# EAGLE schematic CNC (EAGLE 9.2.0)
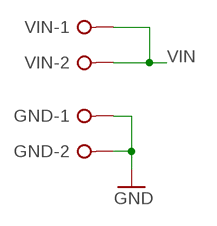
[diagram p0: schematic, sheet 1, part 1 of 2]
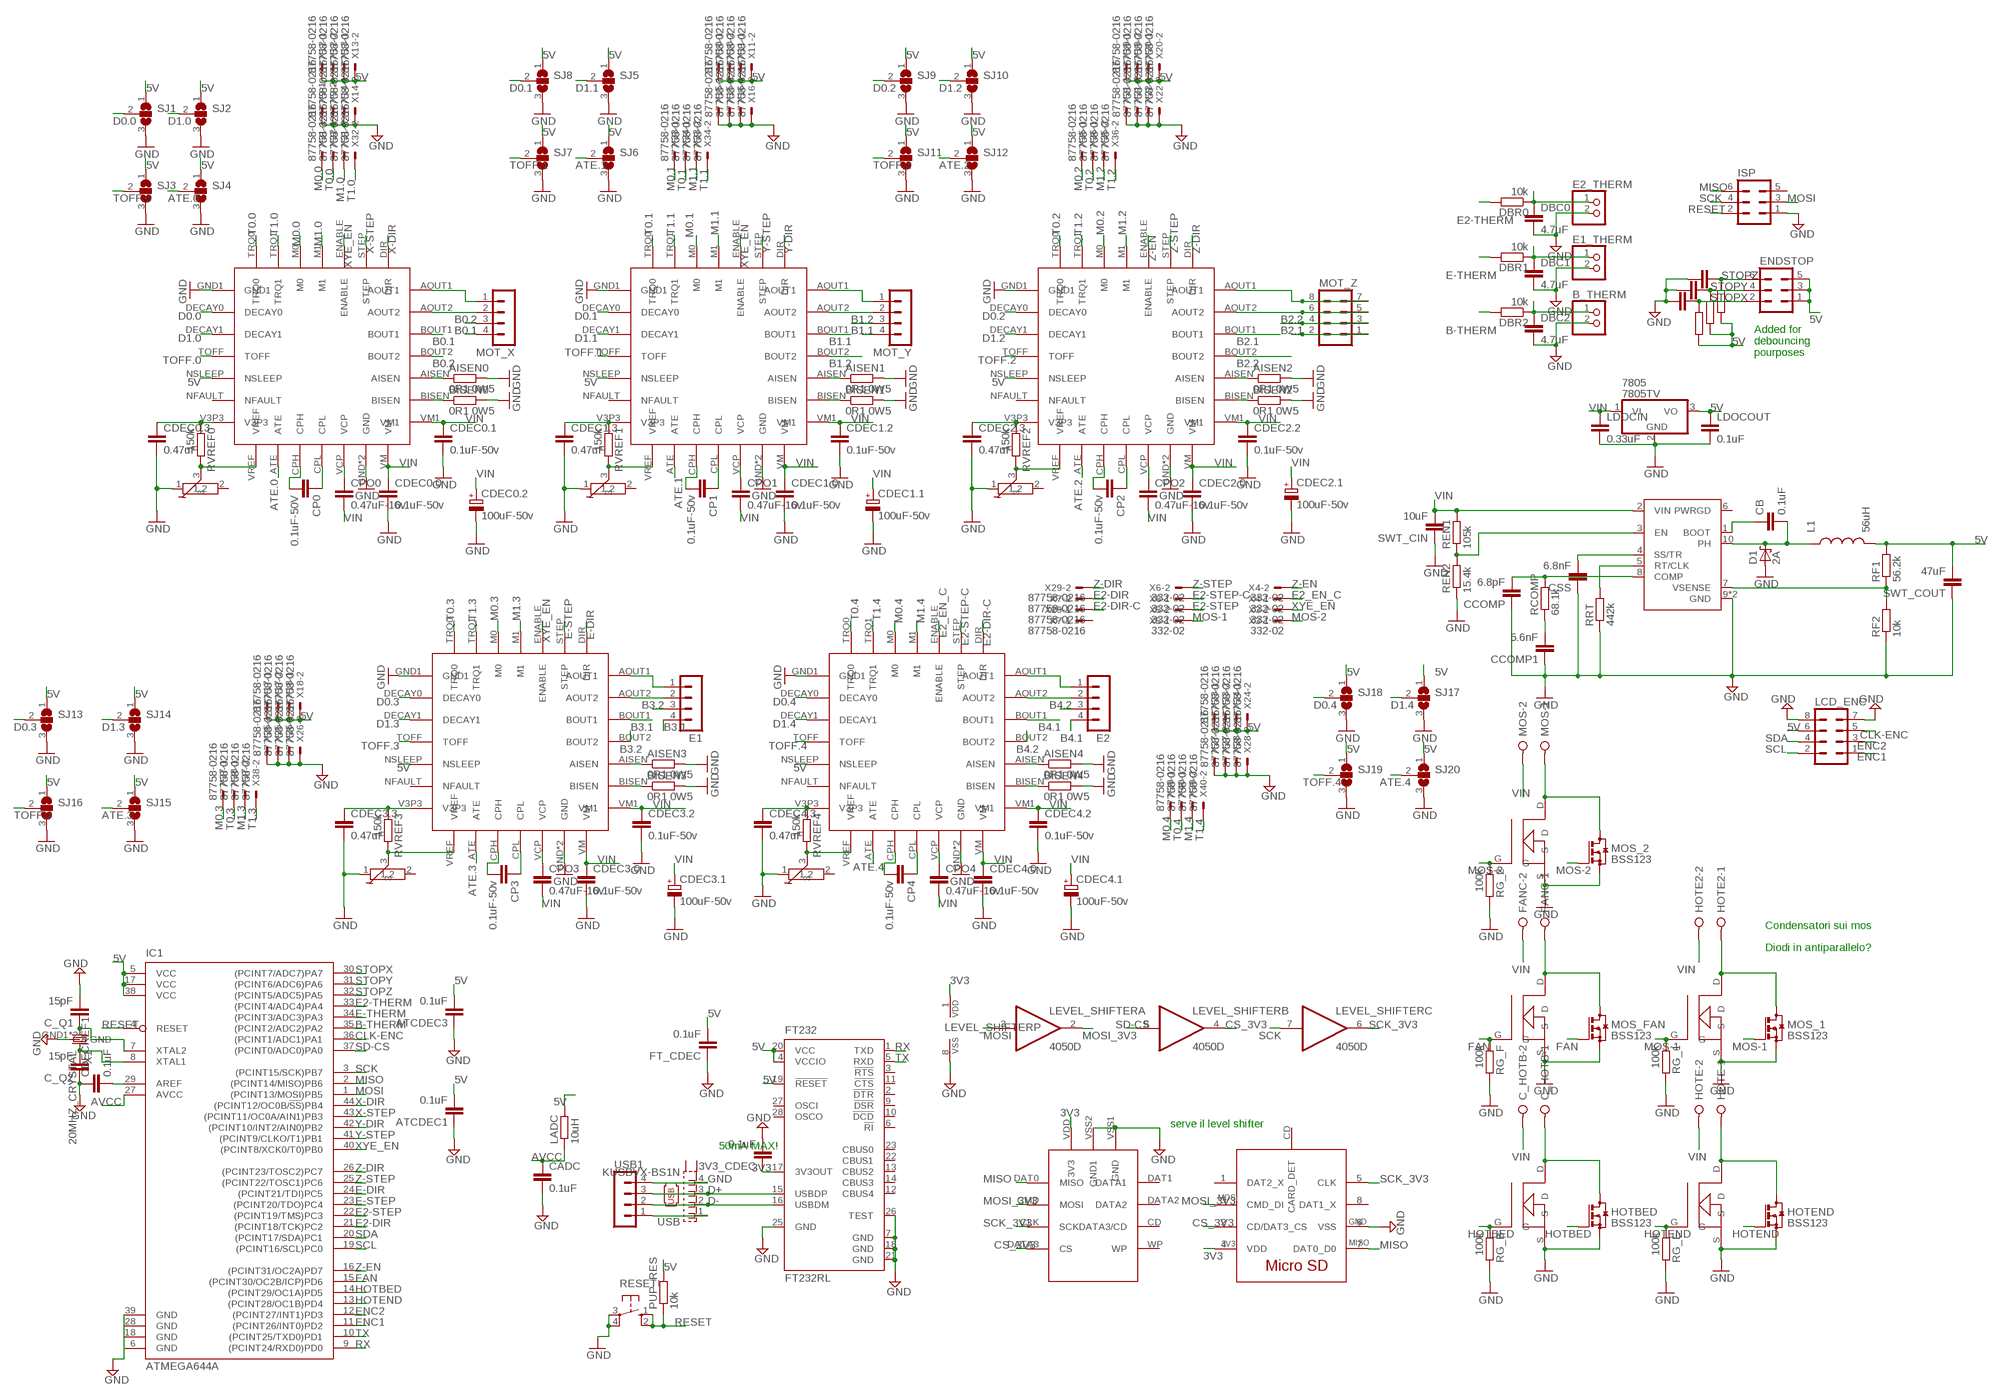
[diagram p1: schematic, sheet 1, part 2 of 2]

## Parts
3V3_CDEC  0.1uF  C-EUC0603  [C0603]
7805  7805TV  [TO220V]
AISEN0  0R1 0W5  R-EU_R0805  [R0805]
AISEN1  0R1 0W5  R-EU_R0805  [R0805]
AISEN2  0R1 0W5  R-EU_R0805  [R0805]
AISEN3  0R1 0W5  R-EU_R0805  [R0805]
AISEN4  0R1 0W5  R-EU_R0805  [R0805]
ATCDEC1  0.1uF  C-EUC0603  [C0603]
ATCDEC3  0.1uF  C-EUC0603  [C0603]
B_THERM  PINHD-1X2  [1X02]
BISEN0  0R1 0W5  R-EU_R0805  [R0805]
BISEN1  0R1 0W5  R-EU_R0805  [R0805]
BISEN2  0R1 0W5  R-EU_R0805  [R0805]
BISEN3  0R1 0W5  R-EU_R0805  [R0805]
BISEN4  0R1 0W5  R-EU_R0805  [R0805]
C_HOTB  W237-02P  [W237-132]
C_Q1  15pF  C-EUC0603  [C0603]
C_Q2  15pF  C-EUC0603  [C0603]
CADC  0.1uF  C-EUC0603  [C0603]
CB  0.1uF  C-EUC0603  [C0603]
CCOMP  6.8pF  C-EUC0603  [C0603]
CCOMP1  5.6nF  C-EUC0603  [C0603]
CDEC0.0  0.1uF-50v  C-EUC0603  [C0603]
CDEC0.1  0.1uF-50v  C-EUC0603  [C0603]
CDEC0.2  100uF-50v  CPOL-EUE3.5-8  [E3,5-8]
CDEC0.3  0.47uF  C-EUC0603  [C0603]
CDEC1.0  0.1uF-50v  C-EUC0603  [C0603]
CDEC1.1  100uF-50v  CPOL-EUE3.5-8  [E3,5-8]
CDEC1.2  0.1uF-50v  C-EUC0603  [C0603]
CDEC1.3  0.47uF  C-EUC0603  [C0603]
CDEC2.0  0.1uF-50v  C-EUC0603  [C0603]
CDEC2.1  100uF-50v  CPOL-EUE3.5-8  [E3,5-8]
CDEC2.2  0.1uF-50v  C-EUC0603  [C0603]
CDEC2.3  0.47uF  C-EUC0603  [C0603]
CDEC3.0  0.1uF-50v  C-EUC0603  [C0603]
CDEC3.1  100uF-50v  CPOL-EUE3.5-8  [E3,5-8]
CDEC3.2  0.1uF-50v  C-EUC0603  [C0603]
CDEC3.3  0.47uF  C-EUC0603  [C0603]
CDEC4.0  0.1uF-50v  C-EUC0603  [C0603]
CDEC4.1  100uF-50v  CPOL-EUE3.5-8  [E3,5-8]
CDEC4.2  0.1uF-50v  C-EUC0603  [C0603]
CDEC4.3  0.47uF  C-EUC0603  [C0603]
CDECREF1  0.1uF  C-EUC0603  [C0603]
CP0  0.1uF-50V  C-EUC0603  [C0603]
CP1  0.1uF-50v  C-EUC0603  [C0603]
CP2  0.1uF-50v  C-EUC0603  [C0603]
CP3  0.1uF-50v  C-EUC0603  [C0603]
CP4  0.1uF-50v  C-EUC0603  [C0603]
CPO0  0.47uF-16v  C-EUC0603  [C0603]
CPO1  0.47uF-16v  C-EUC0603  [C0603]
CPO2  0.47uF-16v  C-EUC0603  [C0603]
CPO3  0.47uF-16v  C-EUC0603  [C0603]
CPO4  0.47uF-16v  C-EUC0603  [C0603]
CSS  6.8nF  C-EUC0603  [C0603]
D1  2A  MBRS130LT3  [SMB]
DBC0  4.7uF  C-EUC0603  [C0603]
DBC1  4.7uF  C-EUC0603  [C0603]
DBC2  4.7uF  C-EUC0603  [C0603]
DBC3  0.1uF  C-EUC0603  [C0603]
DBC4  0.1uF  C-EUC0603  [C0603]
DBC5  0.1uF  C-EUC0603  [C0603]
DBR0  10k  R-EU_R0603  [R0603]
DBR1  10k  R-EU_R0603  [R0603]
DBR2  10k  R-EU_R0603  [R0603]
DBR3  10k  R-EU_R0603  [R0603]
DBR4  10k  R-EU_R0603  [R0603]
DBR5  10k  R-EU_R0603  [R0603]
E1  MA04-1  [MA04-1]
E1_THERM  PINHD-1X2  [1X02]
E2  MA04-1  [MA04-1]
E2_THERM  PINHD-1X2  [1X02]
ENDSTOP  MA03-2  [MA03-2]
EXT_1  DRV8880  [HTSSOP]
EXT_2  DRV8880  [HTSSOP]
FANC  W237-02P  [W237-132]
FT232  FT232RL  [SSOP28]
FT_CDEC  0.1uF  C-EUC0603  [C0603]
GND  W237-02P  [W237-132]
HOTBED  BSS123  [SOT23]
HOTBED1  POWER_MOSFET  [D2PAK]
HOTE  W237-02P  [W237-132]
HOTE2  W237-02P  [W237-132]
HOTEND  BSS123  [SOT23]
HOTEND1  POWER_MOSFET  [D2PAK]
IC1  ATMEGA644A  [TQFP44]
ISP  MA03-2  [MA03-2]
L1  56uH  INDUCTOR  [INDUCTOR]
LADC  10uH  R-EU_R0603  [R0603]
LCD_ENC  MA04-2  [MA04-2]
LDOCIN  0.33uF  C-EUC0603  [C0603]
LDOCOUT  0.1uF  C-EUC0603  [C0603]
LEVEL_SHIFTER  4050D  [SO16]
MOS  W237-02P  [W237-132]
MOS11  POWER_MOSFET  [D2PAK]
MOS22  POWER_MOSFET  [D2PAK]
MOS_1  BSS123  [SOT23]
MOS_2  BSS123  [SOT23]
MOS_FAN  BSS123  [SOT23]
MOS_FAN1  POWER_MOSFET  [D2PAK]
MOT_X  MA04-1  [MA04-1]
MOT_Y  MA04-1  [MA04-1]
MOT_Z  MA04-2  [MA04-2]
PUP_RES  10k  R-EU_R0603  [R0603]
RCOMP  68.1k  R-EU_R0603  [R0603]
REN1  105k  R-EU_R0603  [R0603]
REN2  15.4k  R-EU_R0603  [R0603]
RESET  10-XX  [B3F-10XX]
RF1  56.2k  R-EU_R0603  [R0603]
RF2  10k  R-EU_R0603  [R0603]
RG_1  100k  R-EU_R0603  [R0603]
RG_2  100k  R-EU_R0603  [R0603]
RG_B  100k  R-EU_R0603  [R0603]
RG_E  100k  R-EU_R0603  [R0603]
RG_F  100k  R-EU_R0603  [R0603]
RRT  442k  R-EU_R0603  [R0603]
RVREF0  150k  R-EU_R0603  [R0603]
RVREF1  150k  R-EU_R0603  [R0603]
RVREF2  150k  R-EU_R0603  [R0603]
RVREF3  150k  R-EU_R0603  [R0603]
RVREF4  150k  R-EU_R0603  [R0603]
SD  SD_CARD  [SD_CARD]
SJ1  SJ2W  [SJ_2]
SJ2  SJ2W  [SJ_2]
SJ3  SJ2W  [SJ_2]
SJ4  SJ2W  [SJ_2]
SJ5  SJ2W  [SJ_2]
SJ6  SJ2W  [SJ_2]
SJ7  SJ2W  [SJ_2]
SJ8  SJ2W  [SJ_2]
SJ9  SJ2W  [SJ_2]
SJ10  SJ2W  [SJ_2]
SJ11  SJ2W  [SJ_2]
SJ12  SJ2W  [SJ_2]
SJ13  SJ2W  [SJ_2]
SJ14  SJ2W  [SJ_2]
SJ15  SJ2W  [SJ_2]
SJ16  SJ2W  [SJ_2]
SJ17  SJ2W  [SJ_2]
SJ18  SJ2W  [SJ_2]
SJ19  SJ2W  [SJ_2]
SJ20  SJ2W  [SJ_2]
SUPPLY  TPS54160  [MSOP]
SWT_CIN  10uF  C-EUC0603  [C0603]
SWT_COUT  47uF  C-EUC0603  [C0603]
T0  100k  TRIMMER  [TRIMMER]
T1  TRIMMER  [TRIMMER]
T2  TRIMMER  [TRIMMER]
T3  TRIMMER  [TRIMMER]
T4  TRIMMER  [TRIMMER]
USB  KUSBVX-BS1N  [KUSBVX-BS1N]
USB1  MA04-1  [MA04-1]
USD  MICRO-SD  [MICRO-SD]
VIN  W237-02P  [W237-132]
X1  20MHZ_CRYSTAL  [SMD-3225_4P]
X3  332-02  [332-02]
X4  332-02  [332-02]
X5  332-02  [332-02]
X6  332-02  [332-02]
X7  87758-0216  [87758-0216]
X9  87758-0216  [87758-0216]
X10  87758-0216  [87758-0216]
X11  87758-0216  [87758-0216]
X12  87758-0216  [87758-0216]
X13  87758-0216  [87758-0216]
X14  87758-0216  [87758-0216]
X15  87758-0216  [87758-0216]
X16  87758-0216  [87758-0216]
X17  87758-0216  [87758-0216]
X18  87758-0216  [87758-0216]
X19  87758-0216  [87758-0216]
X20  87758-0216  [87758-0216]
X21  87758-0216  [87758-0216]
X22  87758-0216  [87758-0216]
X23  87758-0216  [87758-0216]
X24  87758-0216  [87758-0216]
X25  87758-0216  [87758-0216]
X26  87758-0216  [87758-0216]
X27  87758-0216  [87758-0216]
X28  87758-0216  [87758-0216]
X29  87758-0216  [87758-0216]
X31  87758-0216  [87758-0216]
X32  87758-0216  [87758-0216]
X33  87758-0216  [87758-0216]
X34  87758-0216  [87758-0216]
X35  87758-0216  [87758-0216]
X36  87758-0216  [87758-0216]
X37  87758-0216  [87758-0216]
X38  87758-0216  [87758-0216]
X39  87758-0216  [87758-0216]
X40  87758-0216  [87758-0216]
X_AXIS  DRV8880  [HTSSOP]
Y-AXIS  DRV8880  [HTSSOP]
Z_AXIS  DRV8880  [HTSSOP]

## Nets
3V3: 3V3_CDEC.1 FT232.17(3V3OUT) LEVEL_SHIFTER.1(P:VDD) SD.VDD(3V3) USD.4(VDD)
5V: 7805.3(VO) ATCDEC1.2 ATCDEC3.2 DBR3.2 DBR4.2 DBR5.2 ENDSTOP.1 ENDSTOP.3 ENDSTOP.5 EXT_1.NSLEEP EXT_2.NSLEEP FT232.4(VCCIO) FT232.19(!RESET) FT232.20(VCC) FT_CDEC.2 IC1.5(VCC) IC1.17(VCC) IC1.38(VCC) L1.2 LADC.2 LCD_ENC.6 LDOCOUT.1 PUP_RES.2 RF1.2 SJ1.1 SJ2.1 SJ3.1 SJ4.1 SJ5.1 SJ6.1 SJ7.1 SJ8.1 SJ9.1 SJ10.1 SJ11.1 SJ12.1 SJ13.1 SJ14.1 SJ15.1 SJ16.1 SJ17.1 SJ18.1 SJ19.1 SJ20.1 SWT_COUT.2 X10.1 X10.2 X11.1 X11.2 X12.1 X12.2 X13.1 X13.2 X17.1 X17.2 X18.1 X18.2 X19.1 X19.2 X20.1 X20.2 X23.1 X23.2 X24.1 X24.2 X_AXIS.NSLEEP Y-AXIS.NSLEEP Z_AXIS.NSLEEP
ATE.0: SJ4.2 X_AXIS.ATE
ATE.1: SJ6.2 Y-AXIS.ATE
ATE.2: SJ12.2 Z_AXIS.ATE
ATE.3: EXT_1.ATE SJ15.2
ATE.4: EXT_2.ATE SJ20.2
AVCC: CADC.1 IC1.27(AVCC) LADC.1
B0.1: MOT_X.4 X_AXIS.BOUT1
B0.2: MOT_X.3 X_AXIS.BOUT2
B1.1 [PowerIn]: MOT_Y.4 Y-AXIS.BOUT1
B1.2 [PowerIn]: MOT_Y.3 Y-AXIS.BOUT2
B2.1 [PowerIn]: MOT_Z.1 MOT_Z.2 Z_AXIS.BOUT1
B2.2 [PowerIn]: MOT_Z.3 MOT_Z.4 Z_AXIS.BOUT2
B3.1 [PowerIn]: E1.4 EXT_1.BOUT1
B3.2 [PowerIn]: E1.3 EXT_1.BOUT2
B4.1 [PowerIn]: E2.4 EXT_2.BOUT1
B4.2 [PowerIn]: E2.3 EXT_2.BOUT2
B-THERM: DBR2.2 IC1.35((PCINT2/ADC2)PA2)
CLK-ENC: IC1.36((PCINT1/ADC1)PA1) LCD_ENC.5
CS_3V3: LEVEL_SHIFTER.4(B:O) SD.DATA3(CS) USD.2(CD/DAT3_CS)
D0.0: SJ1.2 X_AXIS.DECAY0
D0.1: SJ8.2 Y-AXIS.DECAY0
D0.2: SJ9.2 Z_AXIS.DECAY0
D0.3: EXT_1.DECAY0 SJ13.2
D0.4: EXT_2.DECAY0 SJ18.2
D1.0: SJ2.2 X_AXIS.DECAY1
D1.1: SJ5.2 Y-AXIS.DECAY1
D1.2: SJ10.2 Z_AXIS.DECAY1
D1.3: EXT_1.DECAY1 SJ14.2
D1.4: EXT_2.DECAY1 SJ17.2
D+: FT232.15(USBDP) USB1.3 USB.3
D-: FT232.16(USBDM) USB1.2 USB.2
E2-DIR: IC1.21((PCINT18/TCK)PC2) X7.2
E2-DIR-C: EXT_2.DIR X29.1
E2-STEP: IC1.22((PCINT19/TMS)PC3) X5.2
E2-STEP-C: EXT_2.STEP X6.1
E2-THERM: DBR0.2 IC1.33((PCINT4/ADC4)PA4)
E2_EN_C: EXT_2.ENABLE X4.1
E-DIR: EXT_1.DIR IC1.24((PCINT21/TDI)PC5)
E-STEP: EXT_1.STEP IC1.23((PCINT20/TDO)PC4)
E-THERM: DBR1.2 IC1.34((PCINT3/ADC3)PA3)
ENC1: IC1.11((PCINT26/INT0)PD2) LCD_ENC.1
ENC2: IC1.12((PCINT27/INT1)PD3) LCD_ENC.3
FAN: IC1.15((PCINT30/OC2B/ICP)PD6) MOS_FAN1.G MOS_FAN.1(G) RG_F.1
GND: 3V3_CDEC.2 7805.2(GND) AISEN0.2 AISEN1.2 AISEN2.2 AISEN3.2 AISEN4.2 ATCDEC1.1 ATCDEC3.1 B_THERM.2 BISEN0.2 BISEN1.2 BISEN2.2 BISEN3.2 BISEN4.2 C_Q1.2 C_Q2.1 CADC.2 CCOMP1.1 CCOMP.1 CDEC0.0.2 CDEC0.1.2 CDEC0.2.- CDEC0.3.2 CDEC1.0.2 CDEC1.1.- CDEC1.2.2 CDEC1.3.2 CDEC2.0.2 CDEC2.1.- CDEC2.2.2 CDEC2.3.2 CDEC3.0.2 CDEC3.1.- CDEC3.2.2 CDEC3.3.2 CDEC4.0.2 CDEC4.1.- CDEC4.2.2 CDEC4.3.2 CDECREF1.1 CSS.1 D1.A DBC0.2 DBC1.2 DBC2.2 DBC3.2 DBC4.2 DBC5.2 E1_THERM.2 E2_THERM.2 EXT_1.GND EXT_1.GND1 EXT_1.GND2(GND) EXT_2.GND EXT_2.GND1 EXT_2.GND2(GND) FT232.7(GND) FT232.18(GND) FT232.21(GND) FT232.25(GND) FT232.26(TEST) FT_CDEC.1 GND.1 GND.2 HOTBED1.S HOTBED.2(S) HOTEND1.S HOTEND.2(S) IC1.6(GND) IC1.18(GND) IC1.28(GND) IC1.39(GND) ISP.1 LCD_ENC.7 LCD_ENC.8 LDOCIN.2 LDOCOUT.2 LEVEL_SHIFTER.8(P:VSS) MOS11.S MOS22.S MOS_1.2(S) MOS_2.2(S) MOS_FAN1.S MOS_FAN.2(S) REN2.1 RESET.3(P) RESET.4(P1) RF2.1 RG_1.2 RG_2.2 RG_B.2 RG_E.2 RG_F.2 RRT.1 SD.VSS1(GND) SD.VSS2(GND1) SJ1.3 SJ2.3 SJ3.3 SJ4.3 SJ5.3 SJ6.3 SJ7.3 SJ8.3 SJ9.3 SJ10.3 SJ11.3 SJ12.3 SJ13.3 SJ14.3 SJ15.3 SJ16.3 SJ17.3 SJ18.3 SJ19.3 SJ20.3 SUPPLY.9(GND) SUPPLY.GND SWT_CIN.1 SWT_COUT.1 T0.1 T1.1 T2.1 T3.1 T4.1 USB1.4 USB.4 USD.6(VSS) X1.GND1(GND) X1.GND2(GND) X9.1 X9.2 X14.1 X14.2 X15.1 X15.2 X16.1 X16.2 X21.1 X21.2 X22.1 X22.2 X25.1 X25.2 X26.1 X26.2 X27.1 X27.2 X28.1 X28.2 X_AXIS.GND X_AXIS.GND1 X_AXIS.GND2(GND) Y-AXIS.GND Y-AXIS.GND1 Y-AXIS.GND2(GND) Z_AXIS.GND Z_AXIS.GND1 Z_AXIS.GND2(GND)
HOTBED: HOTBED1.G HOTBED.1(G) IC1.14((PCINT29/OC1A)PD5) RG_B.1
HOTEND: HOTEND1.G HOTEND.1(G) IC1.13((PCINT28/OC1B)PD4) RG_E.1
M0.0: X31.1 X_AXIS.M0
M0.1: X33.1 Y-AXIS.M0
M0.2: X35.1 Z_AXIS.M0
M0.3: EXT_1.M0 X37.1
M0.4: EXT_2.M0 X39.1
M1.0: X31.2 X_AXIS.M1
M1.1: X33.2 Y-AXIS.M1
M1.2: X35.2 Z_AXIS.M1
M1.3: EXT_1.M1 X37.2
M1.4: EXT_2.M1 X39.2
MISO: IC1.2((PCINT14/MISO)PB6) ISP.6 SD.DAT0(MISO) USD.7(DAT0_D0)
MOS-1: MOS11.G MOS_1.1(G) RG_1.1 X5.1
MOS-2: MOS22.G MOS_2.1(G) RG_2.1 X3.1
MOSI: IC1.1((PCINT13/MOSI)PB5) ISP.3 LEVEL_SHIFTER.3(A:I)
MOSI_3V3: LEVEL_SHIFTER.2(A:O) SD.CMD(MOSI) USD.3(CMD_DI)
N$1: DBC1.1 DBR1.1 E1_THERM.1
N$2: DBC0.1 DBR0.1 E2_THERM.1
N$3: REN1.1 REN2.2 SUPPLY.3(EN)
N$4: USB1.1 USB.1
N$5 [PowerIn]: MOT_Y.1 Y-AXIS.AOUT1
N$6 [PowerIn]: MOT_Y.2 Y-AXIS.AOUT2
N$9 [PowerIn]: MOT_X.1 X_AXIS.AOUT1
N$10 [PowerIn]: MOT_X.2 X_AXIS.AOUT2
N$13 [PowerIn]: MOT_Z.7 MOT_Z.8 Z_AXIS.AOUT1
N$14 [PowerIn]: MOT_Z.5 MOT_Z.6 Z_AXIS.AOUT2
N$17 [PowerIn]: E1.1 EXT_1.AOUT1
N$18 [PowerIn]: E1.2 EXT_1.AOUT2
N$21 [PowerIn]: E2.2 EXT_2.AOUT2
N$22 [PowerIn]: E2.1 EXT_2.AOUT1
N$25: RRT.2 SUPPLY.5(RT/CLK)
N$26: MOS22.D MOS.1 MOS_2.3(D)
N$29: CDEC0.3.1 RVREF0.1 X_AXIS.V3P3
N$30: CDEC1.3.1 RVREF1.1 Y-AXIS.V3P3
N$31 [PowerIn]: CPO4.1 EXT_2.VCP
N$32 [PowerIn]: CP4.1 EXT_2.CPL
N$33 [PowerIn]: CP4.2 EXT_2.CPH
N$34: CDEC2.3.1 RVREF2.1 Z_AXIS.V3P3
N$35: CDEC4.3.1 EXT_2.V3P3 RVREF4.1
N$36 [PowerIn]: CPO3.1 EXT_1.VCP
N$37 [PowerIn]: CP3.1 EXT_1.CPL
N$38 [PowerIn]: CP3.2 EXT_1.CPH
N$39: CDEC3.3.1 EXT_1.V3P3 RVREF3.1
N$40 [PowerIn]: CPO0.1 X_AXIS.VCP
N$41 [PowerIn]: CP0.1 X_AXIS.CPL
N$42 [PowerIn]: CP0.2 X_AXIS.CPH
N$44: FANC.1 MOS_FAN1.D MOS_FAN.3(D)
N$45: HOTE2.1 MOS11.D MOS_1.3(D)
N$46 [PowerIn]: CPO1.1 Y-AXIS.VCP
N$47 [PowerIn]: CP1.1 Y-AXIS.CPL
N$48: CP1.2 Y-AXIS.CPH
N$49: HOTE.1 HOTEND1.D HOTEND.3(D)
N$50 [PowerIn]: CPO2.1 Z_AXIS.VCP
N$51: CP2.1 Z_AXIS.CPL
N$52 [PowerIn]: CP2.2 Z_AXIS.CPH
N$53: C_HOTB.1 HOTBED1.D HOTBED.3(D)
N$54: C_Q1.1 IC1.7(XTAL2) X1.X1
N$55: C_Q2.2 IC1.8(XTAL1) X1.X2
N$57: CSS.2 SUPPLY.4(SS/TR)
N$58: CB.1 SUPPLY.1(BOOT)
N$59: CCOMP1.2 RCOMP.1
N$60 [PowerIn]: AISEN1.1 Y-AXIS.AISEN
N$61 [PowerIn]: BISEN1.1 Y-AXIS.BISEN
N$62 [PowerIn]: AISEN2.1 Z_AXIS.AISEN
N$63 [PowerIn]: BISEN2.1 Z_AXIS.BISEN
N$64 [PowerIn]: AISEN3.1 EXT_1.AISEN
N$65 [PowerIn]: BISEN3.1 EXT_1.BISEN
N$66 [PowerIn]: AISEN4.1 EXT_2.AISEN
N$67 [PowerIn]: BISEN4.1 EXT_2.BISEN
N$68 [PowerIn]: AISEN0.1 X_AXIS.AISEN
N$69 [PowerIn]: BISEN0.1 X_AXIS.BISEN
N$70: EXT_2.VREF RVREF4.2 T4.3
N$71: EXT_1.VREF RVREF3.2 T3.3
N$72: RVREF0.2 T0.3 X_AXIS.VREF
N$73: RVREF1.2 T1.3 Y-AXIS.VREF
N$74: RVREF2.2 T2.3 Z_AXIS.VREF
N$75: CCOMP.2 RCOMP.2 SUPPLY.8(COMP)
N$76: CDECREF1.2 IC1.29(AREF)
N$77: CB.2 D1.C L1.1 SUPPLY.10(PH)
N$78: B_THERM.1 DBC2.1 DBR2.1
N$79: RF1.1 RF2.2 SUPPLY.7(VSENSE)
RESET: IC1.4(RESET) ISP.2 PUP_RES.1 RESET.1(S) RESET.2(S1)
RX: FT232.1(TXD) IC1.9((PCINT24/RXD0)PD0)
SCK: IC1.3((PCINT15/SCK)PB7) ISP.4 LEVEL_SHIFTER.7(C:I)
SCK_3V3: LEVEL_SHIFTER.6(C:O) SD.CLK(SCK) USD.5(CLK)
SCL: IC1.19((PCINT16/SCL)PC0) LCD_ENC.2
SD-CS: IC1.37((PCINT0/ADC0)PA0) LEVEL_SHIFTER.5(B:I)
SDA: IC1.20((PCINT17/SDA)PC1) LCD_ENC.4
STOPX: DBC3.1 DBR3.1 ENDSTOP.2 IC1.30((PCINT7/ADC7)PA7)
STOPY: DBC4.1 DBR4.1 ENDSTOP.4 IC1.31((PCINT6/ADC6)PA6)
STOPZ: DBC5.1 DBR5.1 ENDSTOP.6 IC1.32((PCINT5/ADC5)PA5)
T0.0: X32.1 X_AXIS.TRQ0
T0.1: X34.1 Y-AXIS.TRQ0
T0.2: X36.1 Z_AXIS.TRQ0
T0.3: EXT_1.TRQ0 X38.1
T0.4: EXT_2.TRQ0 X40.1
T1.0: X32.2 X_AXIS.TRQ1
T1.1: X34.2 Y-AXIS.TRQ1
T1.2: X36.2 Z_AXIS.TRQ1
T1.3: EXT_1.TRQ1 X38.2
T1.4: EXT_2.TRQ1 X40.2
TOFF.0: SJ3.2 X_AXIS.TOFF
TOFF.1: SJ7.2 Y-AXIS.TOFF
TOFF.2: SJ11.2 Z_AXIS.TOFF
TOFF.3: EXT_1.TOFF SJ16.2
TOFF.4: EXT_2.TOFF SJ19.2
TX: FT232.5(RXD) IC1.10((PCINT25/TXD0)PD1)
VIN [PowerIn]: 7805.1(VI) C_HOTB.2 CDEC0.0.1 CDEC0.1.1 CDEC0.2.+ CDEC1.0.1 CDEC1.1.+ CDEC1.2.1 CDEC2.0.1 CDEC2.1.+ CDEC2.2.1 CDEC3.0.1 CDEC3.1.+ CDEC3.2.1 CDEC4.0.1 CDEC4.1.+ CDEC4.2.1 CPO0.2 CPO1.2 CPO2.2 CPO3.2 CPO4.2 EXT_1.VM EXT_1.VM1 EXT_2.VM EXT_2.VM1 FANC.2 HOTE2.2 HOTE.2 LDOCIN.1 MOS.2 REN1.2 SUPPLY.2(VIN) SWT_CIN.2 VIN.1 VIN.2 X_AXIS.VM X_AXIS.VM1 Y-AXIS.VM Y-AXIS.VM1 Z_AXIS.VM Z_AXIS.VM1
X-DIR: IC1.44((PCINT12/OC0B/!SS!)PB4) X_AXIS.DIR
X-STEP: IC1.43((PCINT11/OC0A/AIN1)PB3) X_AXIS.STEP
XYE_EN: EXT_1.ENABLE IC1.40((PCINT8/XCK0/T0)PB0) X3.2 X_AXIS.ENABLE Y-AXIS.ENABLE
Y-DIR: IC1.42((PCINT10/INT2/AIN0)PB2) Y-AXIS.DIR
Y-STEP: IC1.41((PCINT9/CLKO/T1)PB1) Y-AXIS.STEP
Z-DIR: IC1.26((PCINT23/TOSC2)PC7) X29.2 Z_AXIS.DIR
Z-EN: IC1.16((PCINT31/OC2A)PD7) X4.2 Z_AXIS.ENABLE
Z-STEP: IC1.25((PCINT22/TOSC1)PC6) X6.2 Z_AXIS.STEP
Unconnected: EXT_1.NFAULT EXT_2.NFAULT FT232.2(!DTR) FT232.3(!RTS) FT232.6(!RI) FT232.9(!DSR) FT232.10(!DCD) FT232.11(!CTS) FT232.12(CBUS4) FT232.13(CBUS2) FT232.14(CBUS3) FT232.22(CBUS1) FT232.23(CBUS0) FT232.27(OSCI) FT232.28(OSCO) ISP.5 LEVEL_SHIFTER.9(D:I) LEVEL_SHIFTER.10(D:O) LEVEL_SHIFTER.11(E:I) LEVEL_SHIFTER.12(E:O) LEVEL_SHIFTER.14(F:I) LEVEL_SHIFTER.15(F:O) SD.CD(DATA3/CD) SD.DAT1(DATA1) SD.DATA2 SD.WP SUPPLY.6(PWRGD) T0.2 T1.2 T2.2 T3.2 T4.2 USB.M1(S1) USB.M2(S2) USD.1(DAT2_X) USD.8(DAT1_X) USD.CD(CARD_DET) X7.1 X_AXIS.NFAULT Y-AXIS.NFAULT Z_AXIS.NFAULT

## Notes on the sheet
- Added for 
  debouncing
  pourposes
- Condensatori sui mos
- Diodi in antiparallelo?
- serve il level shifter
- 50mA MAX!

## Library data of the parts
3V3_CDEC ATCDEC1 ATCDEC3 C_Q1 C_Q2 CADC CB CCOMP CCOMP1 CDEC0.0 CDEC0.1 CDEC0.3 CDEC1.0 CDEC1.2 CDEC1.3 CDEC2.0 CDEC2.2 CDEC2.3 CDEC3.0 CDEC3.2 CDEC3.3 CDEC4.0 CDEC4.2 CDEC4.3 CDECREF1 CP0 CP1-CP4 CPO0 CPO1-CPO4 CSS DBC0 DBC1-DBC5 FT_CDEC LDOCIN LDOCOUT SWT_CIN SWT_COUT = rcl:C-EU: CAPACITOR, European symbol; SPICEPREFIX: C
7805 = linear:78*: Positive VOLTAGE REGULATOR Source: http://cache.national.com/ds/LM/LM78L05.pdf http://www.fairchildsemi.com/ds/LM/LM7805.pdf
AISEN0 AISEN1-AISEN4 BISEN0 BISEN1-BISEN4 DBR0 DBR1-DBR5 LADC PUP_RES RCOMP REN1 REN2 RF1 RF2 RG_1 RG_2 RG_B RG_E RG_F RRT RVREF0 RVREF1-RVREF4 = rcl:R-EU_: RESISTOR, European symbol; SPICEPREFIX: R
B_THERM E1_THERM E2_THERM = pinhead:PINHD-1X2: PIN HEADER
C_HOTB FANC GND HOTE HOTE2 MOS VIN = con-wago-508:W237-02P: WAGO SREW CLAMP; OC_FARNELL: unknown; OC_NEWARK: unknown
CDEC0.2 CDEC1.1 CDEC2.1 CDEC3.1 CDEC4.1 = rcl:CPOL-EU: POLARIZED CAPACITOR, European symbol; SPICEPREFIX: C
D1 = diode:MBRS130LT3: Schottky Power Rectifier Source: http://www.onsemi.com/pub/Collateral/MBRS130LT3-D.PDF
E1 E2 MOT_X MOT_Y USB1 = con-lstb:MA04-1: PIN HEADER; OC_FARNELL: unknown; OC_NEWARK: unknown
ENDSTOP ISP = con-lstb:MA03-2: PIN HEADER; OC_FARNELL: unknown; OC_NEWARK: unknown
EXT_1 EXT_2 X_AXIS Y-AXIS Z_AXIS = Giordy:DRV8880
FT232 = ftdichip:FT232R: Source: http://www.ftdichip.com/Documents/DataSheets/DS_FT232R_v104.pdf; MPN: FT232RL; OC_FARNELL: 1146032; OC_NEWARK: 91K9918
HOTBED HOTEND MOS_1 MOS_2 MOS_FAN = transistor-small-signal:BSS123: N-CHANNEL MOS FET
HOTBED1 HOTEND1 MOS11 MOS22 MOS_FAN1 = Giordy:POWER_MOSFET
IC1 = atmel:ATMEGA644: 8-bit Microcontroller with 64K Bytes In-System Programmable Flash Source: http://www.atmel.com/dyn/resources/prod_documents/doc2593.pdf; MPN: ATMEGA644PV-10AU; OC_FARNELL: 1455123; OC_NEWARK: 58M3748
L1 = Giordy:INDUCTOR
LCD_ENC MOT_Z = con-lstb:MA04-2: PIN HEADER; OC_FARNELL: unknown; OC_NEWARK: unknown
LEVEL_SHIFTER = 40xx:4050: Hex non-inverting BUFFER
RESET = switch-omron:10-XX: OMRON SWITCH; MPN: B3F-1000; OC_FARNELL: 176432; OC_NEWARK: 36M3542
SD = Giordy:SD_CARD
SJ1-SJ20 = jumper:SJ2W: SMD solder JUMPER
SUPPLY = Giordy:TPS54160
T0 T1-T4 = Giordy:TRIMMER
USB = con-kycon:KUSBVX-BS1N: USB B-type Receptacle Vertical, 4 Position, Through Hole Source: Sibalco Kycon KUSBVX-BS1N-xxx.pdf
USD = Giordy:MICRO-SD
X1 = Giordy:20MHZ_CRYSTAL
X3-X6 = con-garry:332-02: 2 Pin - 2mm Dual Row Source: www.mpe-connector.de / garry_shortform_2012.pdf
X7 X9-X29 X31-X40 = con-molex:87758-0216: 2 Pin - 2mm Dual Row Single Wafer, Vertical T/H HDR Source: http://www.molex.com/pdm_docs/sd/877580616_sd.pdf; MF: MOLEX; MPN: 87758-0216; OC_FARNELL: unknown; OC_NEWARK: 94M1513

## Net classes
0 default: width 0.152 mm, clearance 0.152 mm
1 PowerIn: width 0.254 mm, clearance 0.152 mm